# EAGLE design BSD Final Design (EAGLE 6.5.0)
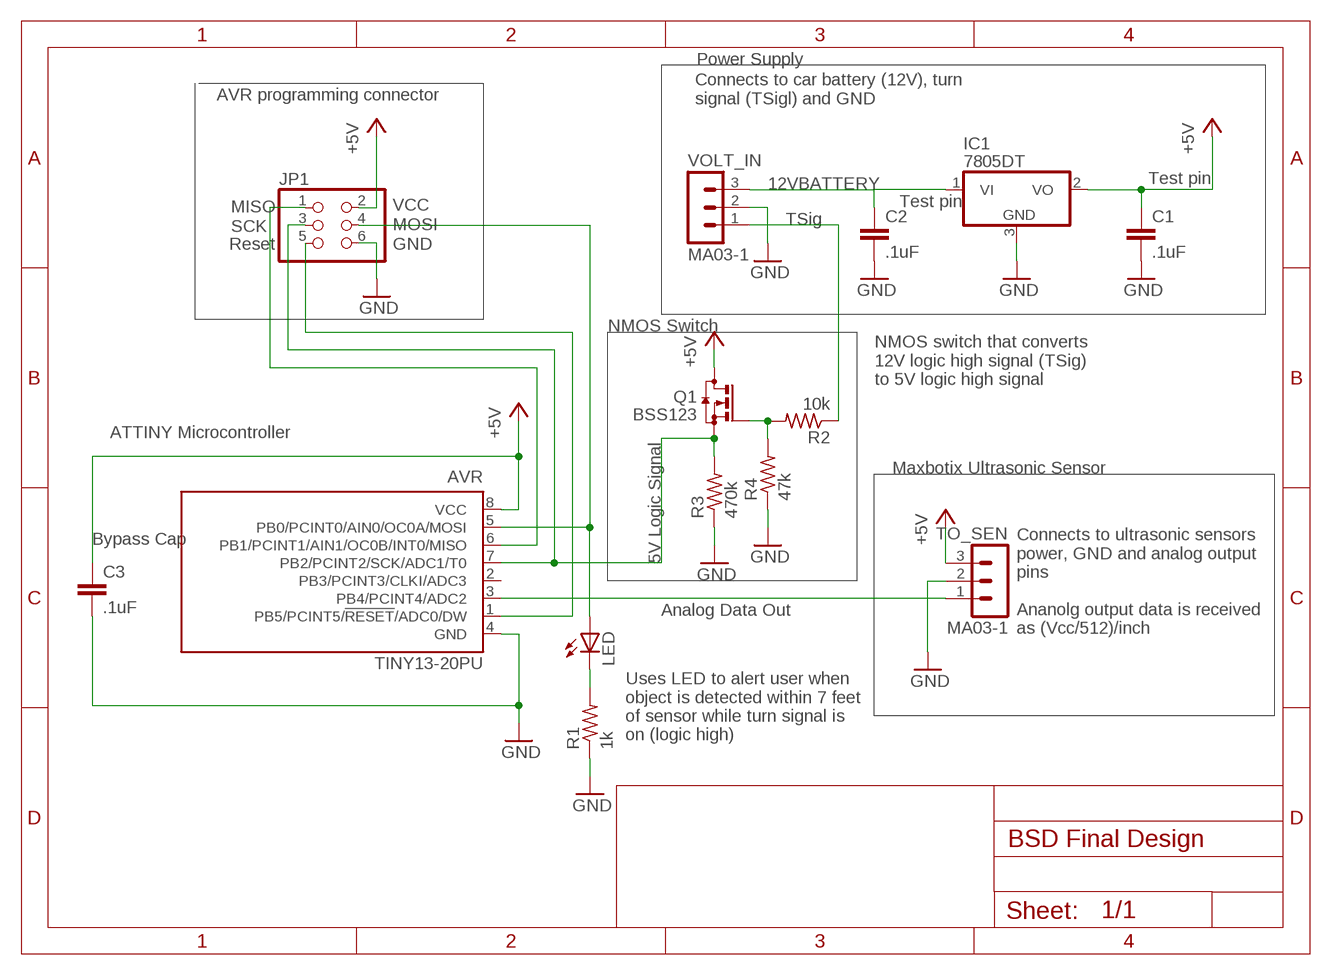
[diagram p0: schematic, sheet 1]

## Parts
AVR  TINY13-20PU  [DIL08]
C1  .1uF  C-EUC0805  [C0805]
C2  .1uF  C-EUC0805  [C0805]
C3  .1uF  C-EUC0805  [C0805]
IC1  7805DT  [TO252]
JP1  PINHD-2X3  [2X03]
LED  LED5MM  [LED5MM]
Q1  BSS123  [SOT23]
R1  1k  R-US_R0805  [R0805]
R2  10k  R-US_R0805  [R0805]
R3  470k  R-US_R0805  [R0805]
R4  47k  R-US_R0805  [R0805]
TO_SEN  MA03-1  [MA03-1]
VOLT_IN  MA03-1  [MA03-1]

## Nets
2N7000: AVR.7(PB2/PCINT2/SCK/ADC1/T0) JP1.3 Q1.2(S) R3.2
12VBATTERY: C2.1 IC1.1(VI) VOLT_IN.3
+5V: AVR.8(VCC) C1.1 C3.1 IC1.2(VO) JP1.2 Q1.3(D) TO_SEN.3
GND: AVR.4(GND) C1.2 C2.2 C3.2 IC1.3(GND) JP1.6 R1.1 R3.1 R4.1 TO_SEN.2 VOLT_IN.2
N$1: AVR.3(PB4/PCINT4/ADC2) TO_SEN.1
N$4: AVR.5(PB0/PCINT0/AIN0/OC0A/MOSI) JP1.4 LED.A
N$5: R2.1 VOLT_IN.1
N$6: Q1.1(G) R2.2 R4.2
N$7: AVR.1(PB5/PCINT5/!RESET!/ADC0/DW) JP1.5
N$9: AVR.6(PB1/PCINT1/AIN1/OC0B/INT0/MISO) JP1.1
RLED: LED.K(C) R1.2
Unconnected: AVR.2(PB3/PCINT3/CLKI/ADC3)

## Notes on the sheet
- Power Supply
- AVR programming connector
- Connects to car battery (12V), turn 
  signal (TSigl) and GND
- Test pin
- VCC | Test pin
- MISO
- TSig
- SCK | MOSI
- Reset | GND
- NMOS Switch
- NMOS switch that converts
  12V logic high signal (TSig)
  to 5V logic high signal
- ATTINY Microcontroller
- Maxbotix Ultrasonic Sensor
- Bypass Cap
- 5V Logic Signal
- Analog Data Out
- Connects to ultrasonic sensors 
  power, GND and analog output 
  pins
  
  Ananolg output data is received
  as (Vcc/512)/inch
- Uses LED to alert user when 
  object is detected within 7 feet
  of sensor while turn signal is
  on (logic high)

## Library data of the parts
AVR = atmel:TINY13: 8-bit AVR Microcontroller with 1K Bytes In-System Programmable Flash Source: http://www.atmel.com/dyn/resources/prod_documents/2535S.pdf; MPN: ATTINY13-20PU; OC_FARNELL: 9171550; OC_NEWARK: 96K6521
C1-C3 = rcl:C-EU: CAPACITOR, European symbol
IC1 = linear:78*: Positive VOLTAGE REGULATOR Source: http://cache.national.com/ds/LM/LM78L05.pdf http://www.fairchildsemi.com/ds/LM/LM7805.pdf
JP1 = pinhead:PINHD-2X3: PIN HEADER
LED = led:LED: LED OSRAM: - CHIPLED LG R971, LG N971, LY N971, LG Q971, LY Q971, LO R971, LY R971 LH N974, LH R974 LS Q976, LO Q976, LY Q976 LO Q996 - Hyper CHIPLED LW Q18S LB Q993, LB Q99A, LB R99A - SideLED LS A670, LO A670, LY A670, LG A670, LP A670 LB A673, LV A673, LT A673, LW A673 LH A674 LY A675 LS A676, LA A676, LO A676, LY A676, LW A676 LS A679, LY A679, LG A679 - Hyper Micro SIDELED® LS Y876, LA Y876, LO Y876, LY Y876 LT Y87S - SmartLED LW L88C, LW L88S LB L89C, LB L89S, LG L890 LS L89K, LO L89K, LY L89K LS L896, LA L896, LO L896, LY L896 - TOPLED LS T670, LO T670, LY T670, LG T670, LP T670 LSG T670, LSP T670, LSY T670, LOP T670, LYG T670 LG T671, LOG T671, LSG T671 LB T673, LV T673, LT T673, LW T673 LH T674 LS T676, LA T676, LO T676, LY T676, LB T676, LH T676, LSB T676, LW T676 LB T67C, LV T67C, LT T67C, LS T67K, LO T67K, LY T67K, LW E67C LS E67B, LA E67B, LO E67B, LY E67B, LB E67C, LV E67C, LT E67C LW T67C LS T679, LY T679, LG T679 LS T770, LO T770, LY T770, LG T770, LP T770 LB T773, LV T773, LT T773, LW T773 LH T774 LS E675, LA E675, LY E675, LS T675 LS T776, LA T776, LO T776, LY T776, LB T776 LHGB T686 LT T68C, LB T68C - Hyper Mini TOPLED® LB M676 - Mini TOPLED Santana® LG M470 LS M47K, LO M47K, LY M47K Source: http://www.osram.convergy.de LUXEON: - LUMILED® LXK2-PW12-R00, LXK2-PW12-S00, LXK2-PW14-U00, LXK2-PW14-V00 LXK2-PM12-R00, LXK2-PM12-S00, LXK2-PM14-U00 LXK2-PE12-Q00, LXK2-PE12-R00, LXK2-PE12-S00, LXK2-PE14-T00, LXK2-PE14-U00 LXK2-PB12-K00, LXK2-PB12-L00, LXK2-PB12-M00, LXK2-PB14-N00, LXK2-PB14-P00, LXK2-PB14-Q00 LXK2-PR12-L00, LXK2-PR12-M00, LXK2-PR14-Q00, LXK2-PR14-R00 LXK2-PD12-Q00, LXK2-PD12-R00, LXK2-PD12-S00 LXK2-PH12-R00, LXK2-PH12-S00 LXK2-PL12-P00, LXK2-PL12-Q00, LXK2-PL12-R00 Source: www.luxeon.com KINGBRIGHT: KA-3528ASYC Source: www.kingbright.com
Q1 = transistor-small-signal:BSS123: N-CHANNEL MOS FET
R1-R4 = rcl:R-US_: RESISTOR, American symbol
TO_SEN VOLT_IN = con-lstb:MA03-1: PIN HEADER; OC_FARNELL: unknown; OC_NEWARK: unknown

## Board
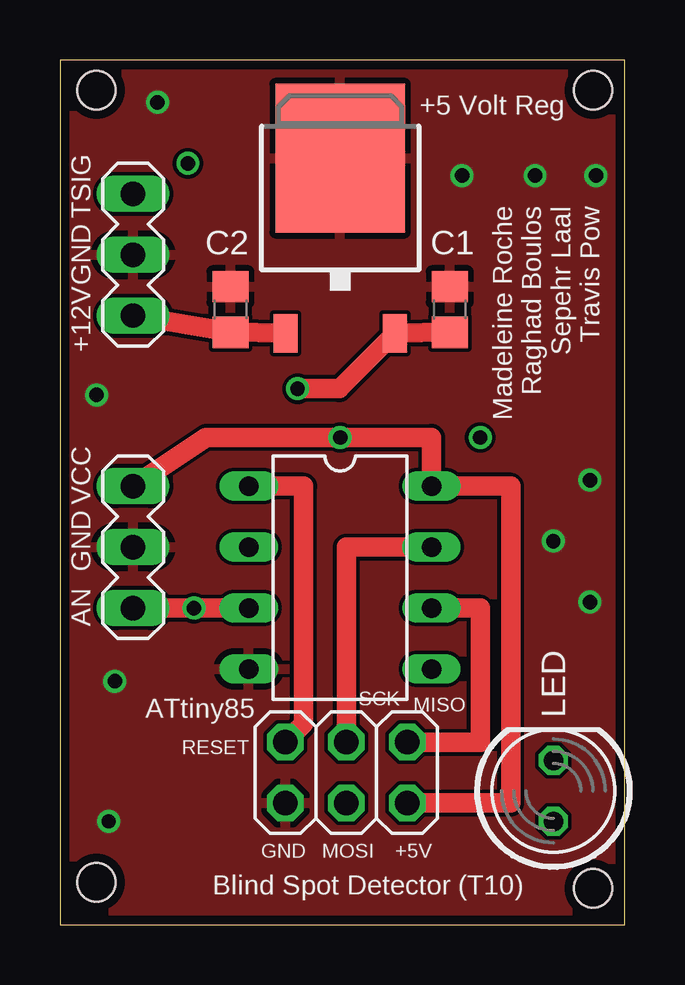
[diagram p1: board, top side]
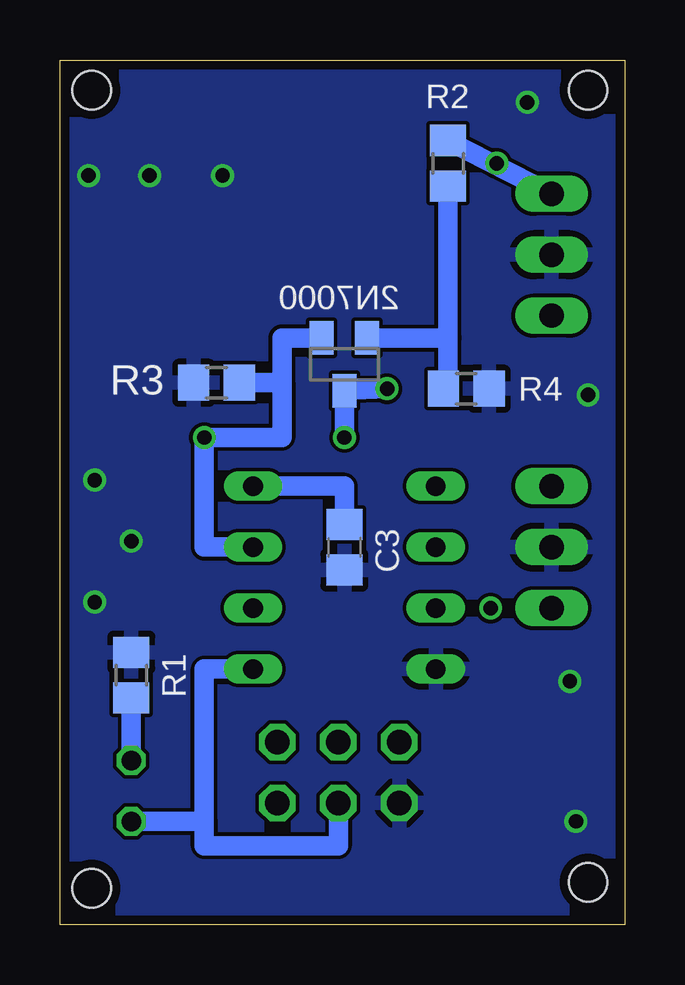
[diagram p2: board, bottom side, seen from below]

Size 23.55 x 36.06 mm. Coordinates in mm from the lower left corner, seen from the top.
Outline: 0,0 23.55,0 23.55,36.06 0,36.06 0,0
Copper layers (1*16): Top 0.0356mm / dielectric 1.5011mm / Bottom 0.0356mm
Design rules "LaenPCBOrder": minimum track width 6mil, minimum drill 13mil, track to track 6mil, track to pad 6mil, pad to pad 6mil, via to via 6mil, smd to smd 6mil, copper to edge 15mil, drill to drill 6mil, minimum pad ring 7mil, minimum via ring 7mil, stop-mask expansion 3mil, vias tented up to drill 0mil, thermal gap 10mil
Holes 1.6 mm at 1.52,1.78 1.52,34.8 22.23,34.8 22.23,1.52

### Footprints (pad centres in the part's own frame; a part is rotated, then mirrored left to right if it is on the bottom)
DIL08 = drill 0.813 long: 1 -3.81,-3.81; 2 -1.27,-3.81; 3 1.27,-3.81; 4 3.81,-3.81; 5 3.81,3.81; 6 1.27,3.81; 7 -1.27,3.81; 8 -3.81,3.81
C0805 = smd 1.3 x 1.5: 1 -0.95,0; 2 0.95,0
TO252 = smd 1 x 1.6: 1 -2.28,-4.8; 2 2.28,-4.8 | smd 5.4 x 6.2: 3 0,2.5
2X03 = drill 1.016 octagon: 1 -2.54,-1.27; 2 -2.54,1.27; 3 0,-1.27; 4 0,1.27; 5 2.54,-1.27; 6 2.54,1.27
LED5MM = drill 0.813 octagon: A -1.27,0; K 1.27,0
SOT23 = smd 1 x 1.4: 1 -0.95,-1.1; 2 0.95,-1.1; 3 0,1.1
R0805 = smd 1.3 x 1.5: 1 -0.95,0; 2 0.95,0
MA03-1 = drill 1.016 long: 1 -2.54,0; 2 0,0; 3 2.54,0

### Placement (x,y rotation side)
AVR  11.68,14.48 270 top
C1  16.26,25.65 90 top
C2  7.11,25.65 90 top
C3  11.68,15.75 270 bottom
IC1  11.68,29.46 0 top
JP1  11.94,6.35 180 top
LED  20.57,5.59 90 top
Q1  11.68,23.37 180 bottom
R1  20.57,10.41 270 bottom
R2  7.37,31.75 270 bottom
R3  17.02,22.61 0 bottom
R4  6.6,22.35 180 bottom
TO_SEN  3.05,15.75 90 top
VOLT_IN  3.05,27.94 270 top

### Tracks (layer width: path | path; a pad name or v marks a point on that pad's centre or on a via)
2N7000  (via drill 0.6)
  Top 0.813: JP1.3 11.94,15.75 AVR.7
  Bottom 0.813: Q1.2 14.29,24.47 14.29,22.61 | AVR.7 17.53,15.75 v17.53,20.32 14.29,20.32 14.29,22.61 | R3.2 14.29,22.61
12VBATTERY
  Top 0.813: VOLT_IN.3 C2.1 IC1.1
+5V  (via drill 0.6)
  Top 0.813: TO_SEN.3 6.1,20.32 v11.68,20.32 15.49,20.32 AVR.8 18.8,18.29 18.8,5.08 JP1.2 | C1.1 IC1.2 11.65,22.35 v9.91,22.35
  Bottom 0.813: v11.68,20.32 Q1.3 v9.91,22.35 | AVR.8 11.68,18.29 C3.1
GND  (via drill 0.6)
  other vias: 2.03,4.32 2.29,10.16 22.1,13.46 20.57,16 22.1,18.54 1.52,22.1 4.06,34.29 16.76,31.24 22.35,31.24 19.81,31.24
  pour Top: -0.51,35.81 23.62,35.81 23.88,0 -0.51,0
  pour Bottom: -0.25,36.07 23.62,36.32 23.62,-0.25 -0.25,0
N$1  (via drill 0.6)
  Top 0.813: TO_SEN.1 v5.59,13.21 AVR.3
N$4
  Bottom 0.813: JP1.4 11.94,3.3 17.53,3.3 17.53,4.32 | 17.53,4.32 17.53,10.67 AVR.5 | LED.A 17.53,4.32
N$5
  Bottom 0.813: VOLT_IN.1 R2.1
N$6
  Bottom 0.813: Q1.1 7.37,24.47 | 7.37,24.47 R2.2 | R4.2 7.37,22.35 7.37,24.47
N$7
  Top 0.813: JP1.5 10.16,8.38 10.16,18.29 AVR.1
N$8  (via drill 0.6)
  other vias: 5.33,31.75
N$9
  Top 0.813: JP1.1 17.53,7.62 17.53,13.21 AVR.6
RLED
  Bottom 0.813: R1.2 LED.K

### Text on the board
tNames: +5 Volt Reg | TSIG | Madeleine Roche / Raghad Boulos / Sepehr Laal / Travis Pow | GND | +12V | VCC | GND | AN | SCK | ATtiny85 | MISO | LED | RESET | GND | MOSI | +5V | Blind Spot Detector (T10)
bNames: 2N7000